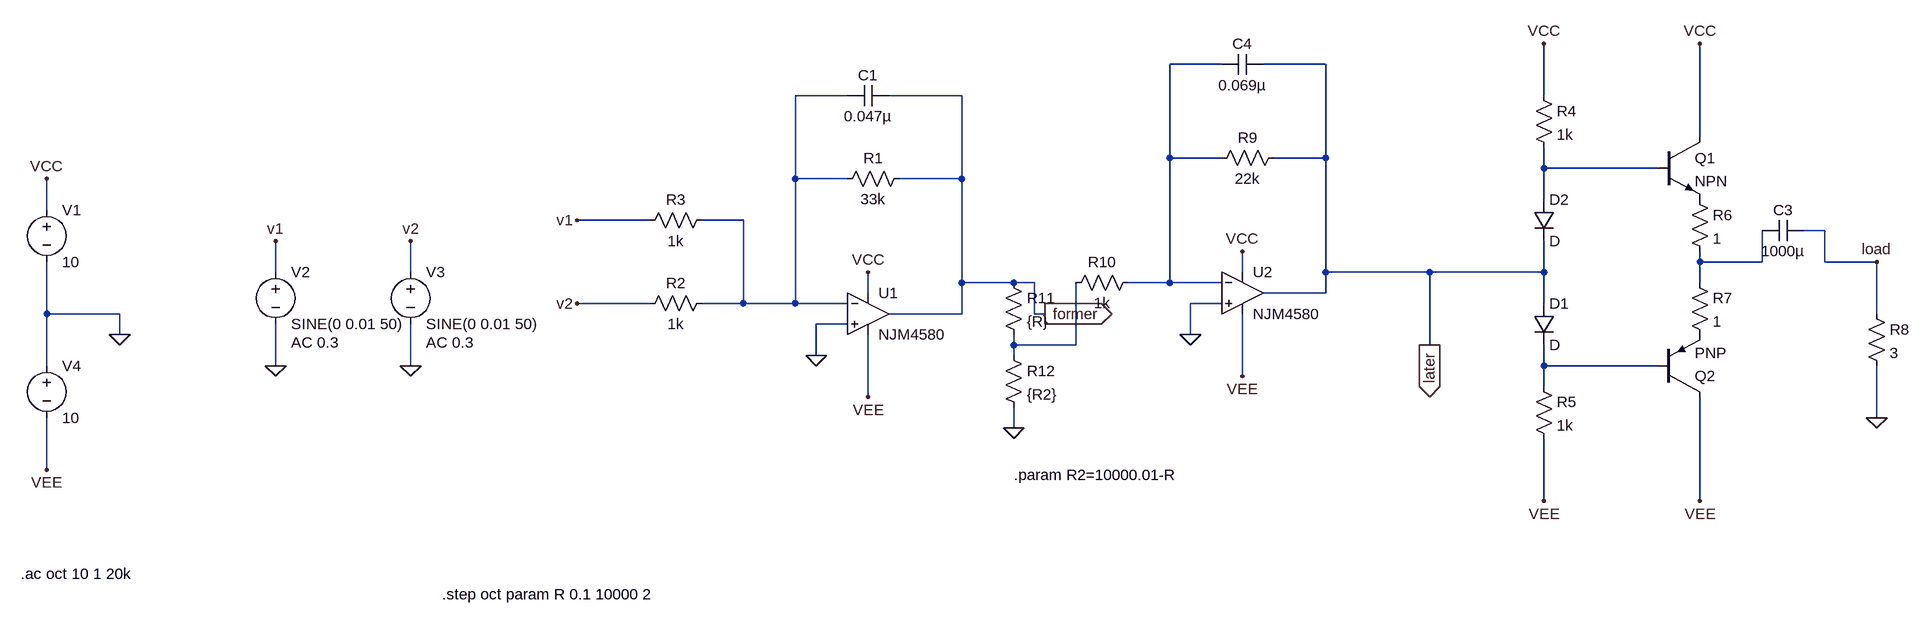
[diagram p0: schematic woofer_amp.asc]
woofer_amp.asc, the LTspice schematic file:
Version 4
SHEET 1 1736 680
WIRE 672 -240 592 -240
WIRE 832 -240 736 -240
WIRE 96 -192 16 -192
WIRE 272 -192 160 -192
WIRE 1168 -192 1168 -272
WIRE 1408 -128 1408 -272
WIRE 592 -96 592 -240
WIRE 672 -96 592 -96
WIRE 832 -96 832 -240
WIRE 832 -96 752 -96
WIRE 1168 -80 1168 -112
WIRE 1344 -80 1168 -80
WIRE 16 -64 16 -192
WIRE 96 -64 16 -64
WIRE 272 -64 272 -192
WIRE 272 -64 176 -64
WIRE 1168 -32 1168 -80
WIRE -1136 -16 -1136 -64
WIRE -208 0 -320 0
WIRE -64 0 -128 0
WIRE 1600 16 1568 16
WIRE 1408 64 1408 48
WIRE 1504 64 1504 16
WIRE 1504 64 1408 64
WIRE 1600 64 1600 16
WIRE 1680 64 1600 64
WIRE -784 80 -784 32
WIRE -576 80 -576 32
WIRE 704 80 704 48
WIRE 832 80 832 -96
WIRE 992 80 832 80
WIRE 1168 80 1168 32
WIRE 1168 80 992 80
WIRE 272 96 272 -64
WIRE 352 96 272 96
WIRE 384 96 352 96
WIRE 592 96 592 -96
WIRE 592 96 528 96
WIRE 672 96 592 96
WIRE 1408 96 1408 64
WIRE 128 112 128 80
WIRE 832 112 832 80
WIRE 832 112 736 112
WIRE -208 128 -320 128
WIRE -64 128 -64 0
WIRE -64 128 -128 128
WIRE 16 128 16 -64
WIRE 16 128 -64 128
WIRE 96 128 16 128
WIRE 672 128 624 128
WIRE 1168 128 1168 80
WIRE -1136 144 -1136 64
WIRE -1024 144 -1136 144
WIRE 272 144 272 96
WIRE 272 144 160 144
WIRE 384 144 384 96
WIRE 400 144 384 144
WIRE 1680 144 1680 64
WIRE 96 160 48 160
WIRE -1024 176 -1024 144
WIRE 624 176 624 128
WIRE 352 192 352 176
WIRE 448 192 448 96
WIRE 448 192 352 192
WIRE 992 192 992 80
WIRE 48 208 48 160
WIRE 352 208 352 192
WIRE -1136 224 -1136 144
WIRE -784 224 -784 160
WIRE -576 224 -576 160
WIRE 1168 224 1168 192
WIRE 1344 224 1168 224
WIRE 704 240 704 144
WIRE 1168 256 1168 224
WIRE 128 272 128 176
WIRE 1680 304 1680 224
WIRE 352 320 352 288
WIRE -1136 384 -1136 304
WIRE 1168 432 1168 336
WIRE 1408 432 1408 272
FLAG 48 208 0
FLAG 400 144 former
IOPIN 400 144 Out
FLAG -1136 -64 VCC
FLAG -1136 384 VEE
FLAG 128 80 VCC
FLAG 128 272 VEE
FLAG -784 32 v1
FLAG -576 32 v2
FLAG -576 224 0
FLAG -784 224 0
FLAG -320 0 v1
FLAG -320 128 v2
FLAG -1024 176 0
FLAG 1168 -272 VCC
FLAG 1168 432 VEE
FLAG 1408 432 VEE
FLAG 1408 -272 VCC
FLAG 1680 304 0
FLAG 1680 64 load
FLAG 624 176 0
FLAG 704 48 VCC
FLAG 704 240 VEE
FLAG 992 192 later
IOPIN 992 192 Out
FLAG 352 320 0
SYMBOL Opamps\\NJM4580 128 80 R0
SYMATTR InstName U1
SYMBOL res 192 -80 R90
WINDOW 0 0 56 VBottom 2
WINDOW 3 32 56 VTop 2
SYMATTR InstName R1
SYMATTR Value 33k
SYMBOL res -112 112 R90
WINDOW 0 0 56 VBottom 2
WINDOW 3 32 56 VTop 2
SYMATTR InstName R2
SYMATTR Value 1k
SYMBOL res -112 -16 R90
WINDOW 0 0 56 VBottom 2
WINDOW 3 32 56 VTop 2
SYMATTR InstName R3
SYMATTR Value 1k
SYMBOL voltage -1136 -32 R0
WINDOW 123 0 0 Left 0
WINDOW 39 0 0 Left 0
SYMATTR InstName V1
SYMATTR Value 10
SYMBOL voltage -784 64 R0
WINDOW 123 24 124 Left 2
WINDOW 39 0 0 Left 0
SYMATTR Value2 AC 0.3
SYMATTR InstName V2
SYMATTR Value SINE(0 0.01 50)
SYMBOL voltage -576 64 R0
WINDOW 123 24 124 Left 2
WINDOW 39 0 0 Left 0
SYMATTR Value2 AC 0.3
SYMATTR InstName V3
SYMATTR Value SINE(0 0.01 50)
SYMBOL voltage -1136 208 R0
WINDOW 123 0 0 Left 0
WINDOW 39 0 0 Left 0
SYMATTR InstName V4
SYMATTR Value 10
SYMBOL diode 1152 128 R0
SYMATTR InstName D1
SYMBOL diode 1152 -32 R0
SYMATTR InstName D2
SYMBOL res 1152 -208 R0
SYMATTR InstName R4
SYMATTR Value 1k
SYMBOL res 1152 240 R0
SYMATTR InstName R5
SYMATTR Value 1k
SYMBOL npn 1344 -128 R0
SYMATTR InstName Q1
SYMBOL pnp 1344 272 M180
SYMATTR InstName Q2
SYMBOL res 1392 -48 R0
SYMATTR InstName R6
SYMATTR Value 1
SYMBOL res 1392 80 R0
SYMATTR InstName R7
SYMATTR Value 1
SYMBOL res 1664 128 R0
SYMATTR InstName R8
SYMATTR Value 3
SYMBOL Opamps\\NJM4580 704 48 R0
SYMATTR InstName U2
SYMBOL res 768 -112 R90
WINDOW 0 0 56 VBottom 2
WINDOW 3 32 56 VTop 2
SYMATTR InstName R9
SYMATTR Value 22k
SYMBOL res 544 80 R90
WINDOW 0 0 56 VBottom 2
WINDOW 3 32 56 VTop 2
SYMATTR InstName R10
SYMATTR Value 1k
SYMBOL cap 160 -208 R90
WINDOW 0 0 32 VBottom 2
WINDOW 3 32 32 VTop 2
SYMATTR InstName C1
SYMATTR Value 0.047µ
SYMBOL cap 1568 0 R90
WINDOW 0 0 32 VBottom 2
WINDOW 3 32 32 VTop 2
SYMATTR InstName C3
SYMATTR Value 1000µ
SYMBOL cap 736 -256 R90
WINDOW 0 0 32 VBottom 2
WINDOW 3 32 32 VTop 2
SYMATTR InstName C4
SYMATTR Value 0.069µ
SYMBOL res 336 80 R0
SYMATTR InstName R11
SYMATTR Value {R}
SYMBOL res 336 192 R0
SYMATTR InstName R12
SYMATTR Value {R2}
TEXT -1176 544 Left 2 !.ac oct 10 1 20k
TEXT -528 576 Left 2 !.step oct param R 0.1 10000 2
TEXT 352 392 Left 2 !.param R2=10000.01-R

The netlist it stands for:
* woofer_amp.asc
XU1 0 N002 VCC VEE former NJM4580  ; pins In+ In- V+ V- OUT
R1 former N002 33k
R2 N002 v2 1k
R3 N002 v1 1k
V1 VCC 0 10
V2 v1 0 SINE(0 0.01 50) AC 0.3
V3 v2 0 SINE(0 0.01 50) AC 0.3
V4 0 VEE 10
D1 later N006 D
D2 N003 later D
R4 VCC N003 1k
R5 N006 VEE 1k
Q1 VCC N003 P001 0 NPN
Q2 VEE N006 P002 0 PNP
R6 P001 N004 1
R7 N004 P002 1
R8 load 0 3
XU2 0 N001 VCC VEE later NJM4580  ; pins In+ In- V+ V- OUT
R9 later N001 22k
R10 N001 N005 1k
C1 former N002 0.047µ
C3 load N004 1000µ
C4 later N001 0.069µ
R11 former N005 {R}
R12 N005 0 {R2}
.model D D
.lib standard.dio
.model NPN NPN
.model PNP PNP
.lib standard.bjt
.ac oct 10 1 20k
.step oct param R 0.1 10000 2
.param R2=10000.01-R
.backanno
.end